# EAGLE design BPW5017-VGA (EAGLE 5.11)
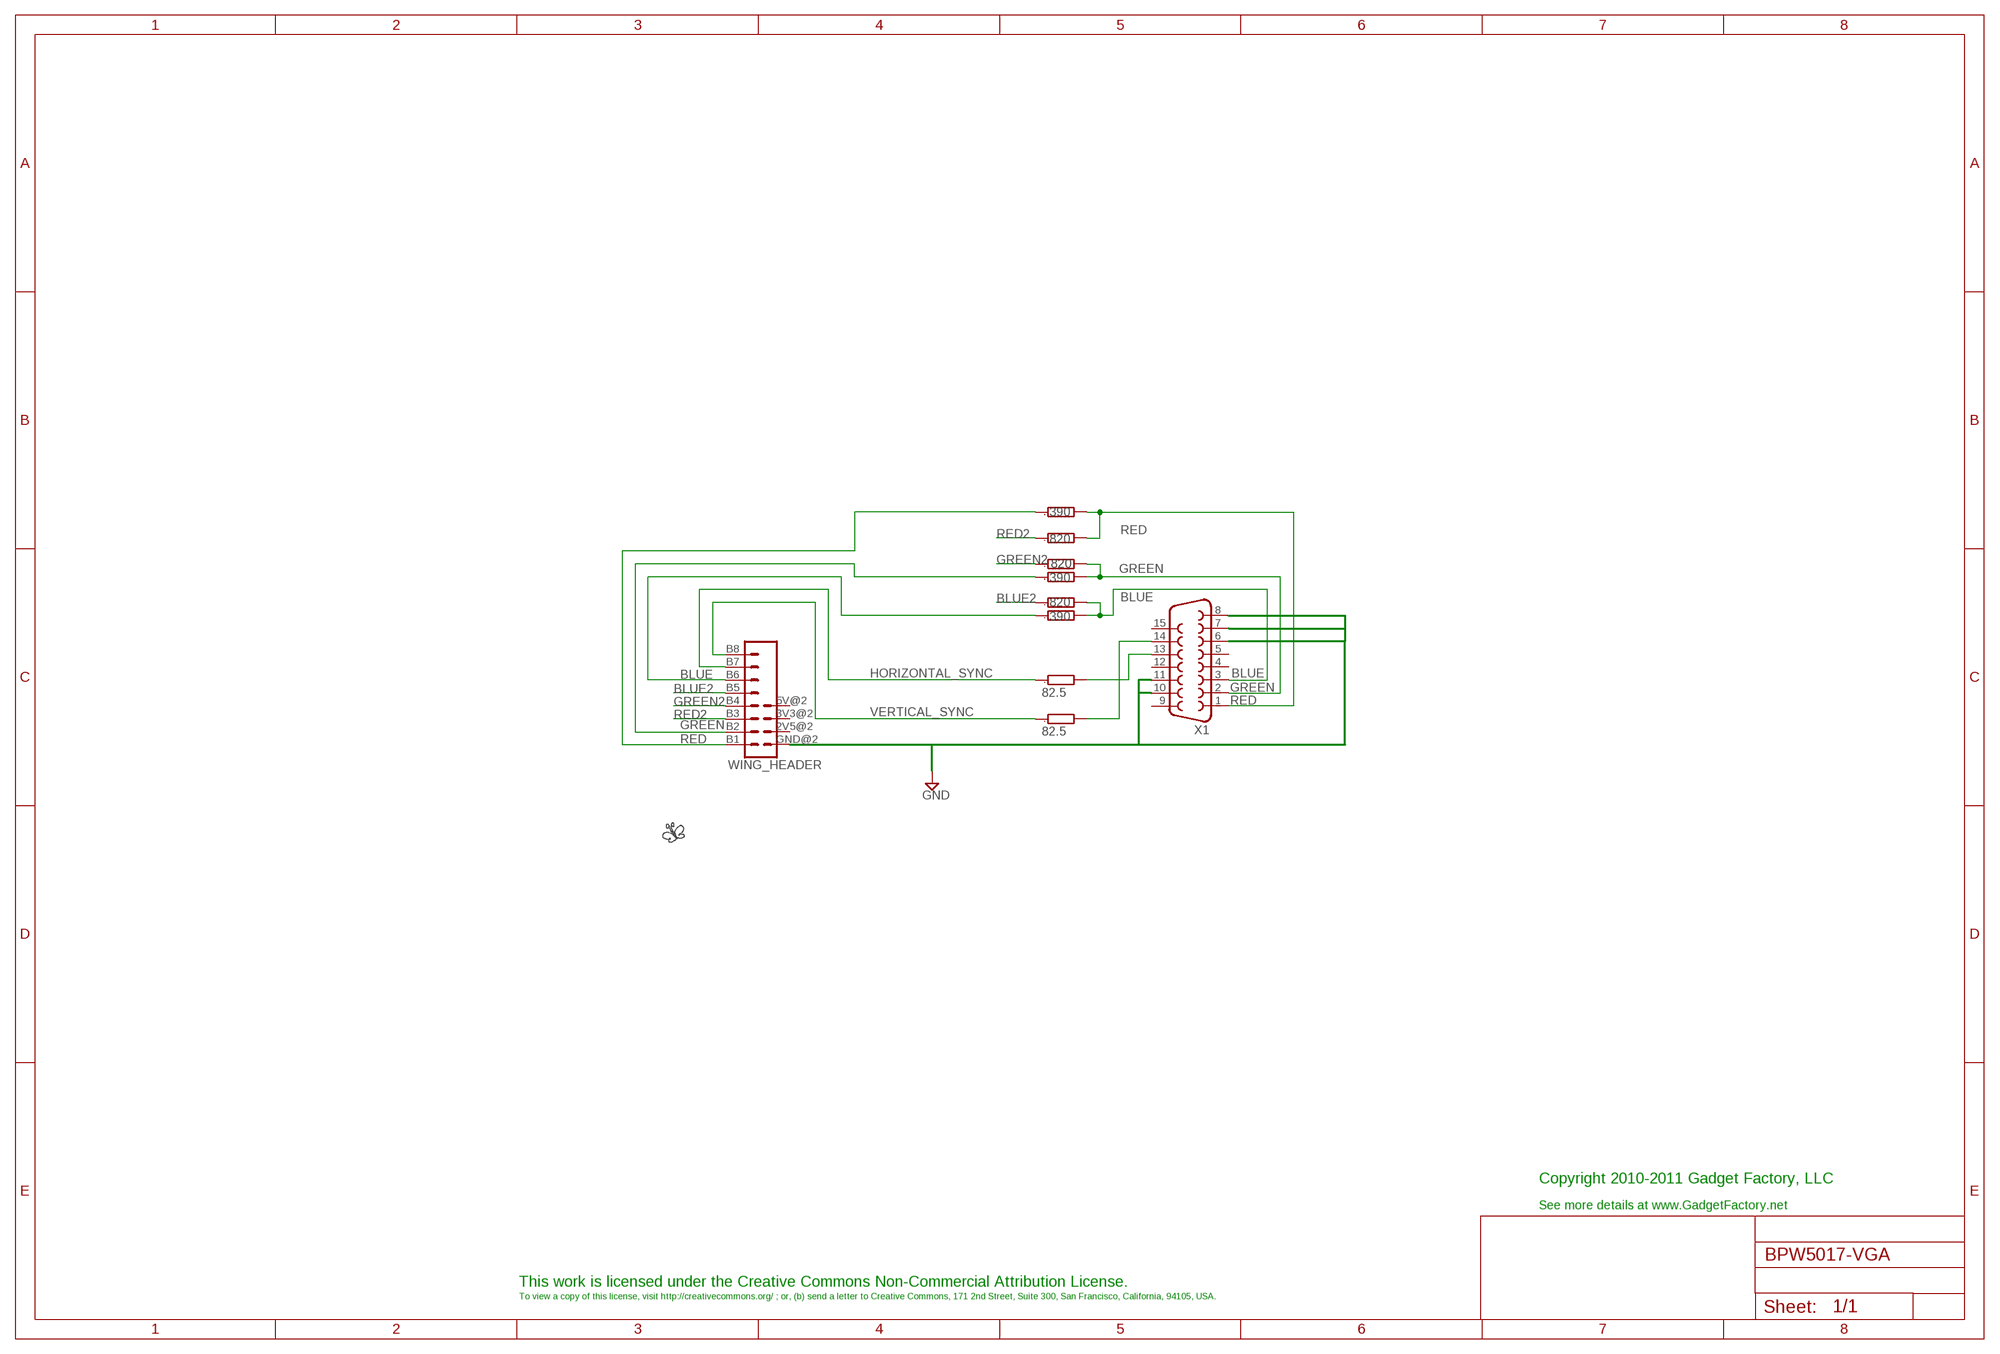
[diagram p0: schematic, sheet 1]

## Parts
LOGO1  BUTTERFLY_LOGO  [BUTTERFLY_LOGO]
R1  390  R  [DUALRESISTOR]
R2  390  R  [DUALRESISTOR]
R3  390  R  [DUALRESISTOR]
R4  820  R  [DUALRESISTOR]
R5  820  R  [DUALRESISTOR]
R6  820  R  [DUALRESISTOR]
R7  82.5  R  [DUALRESISTOR]
R8  82.5  R  [DUALRESISTOR]
WING_HEADER  WING_8BIT  [WINGSIDE_8BIT]
X1  F15HDH  [HDF15H]

## Nets
BLUE: R3.2 R6.2 X1.3
BLUE2: R6.1 WING_HEADER.B5
GND: WING_HEADER.GND@2(GND) X1.6 X1.7 X1.8 X1.10 X1.11
GREEN: R2.2 R5.2 X1.2
GREEN2: R5.1 WING_HEADER.B4
HORIZONTAL_SYNC: R7.1 WING_HEADER.B7
N$4: R7.2 X1.13
N$5: R8.2 X1.14
N$6: R1.1 WING_HEADER.B1
N$7: R2.1 WING_HEADER.B2
N$8: R3.1 WING_HEADER.B6
RED: R1.2 R4.2 X1.1
RED2: R4.1 WING_HEADER.B3
VERTICAL_SYNC: R8.1 WING_HEADER.B8
Unconnected: WING_HEADER.2V5@2(2V5) WING_HEADER.3V3@2(3V3) WING_HEADER.5V@2(5V) X1.4 X1.5 X1.9 X1.12 X1.15

## Notes on the sheet
- BLUE
- GREEN
- RED
- Copyright 2010-2011 Gadget Factory, LLC
- See more details at www.GadgetFactory.net
- This work is licensed under the Creative Commons Non-Commercial Attribution License.
- To view a copy of this license, visit http://creativecommons.org/ ; or, (b) send a letter to Creative Commons, 171 2nd Street, Suite 300, San Francisco, California, 94105, USA.

## Library data of the parts
LOGO1 = GadgetFactory_Pub:BUTTERFLY_LOGO
R1-R8 = GadgetFactory:R: RESISTOR, European symbol
WING_HEADER = GadgetFactory_Pub:WING_8BIT
X1 = GadgetFactory:F15: SUB-D; OC_FARNELL: unknown; OC_NEWARK: unknown

## Board
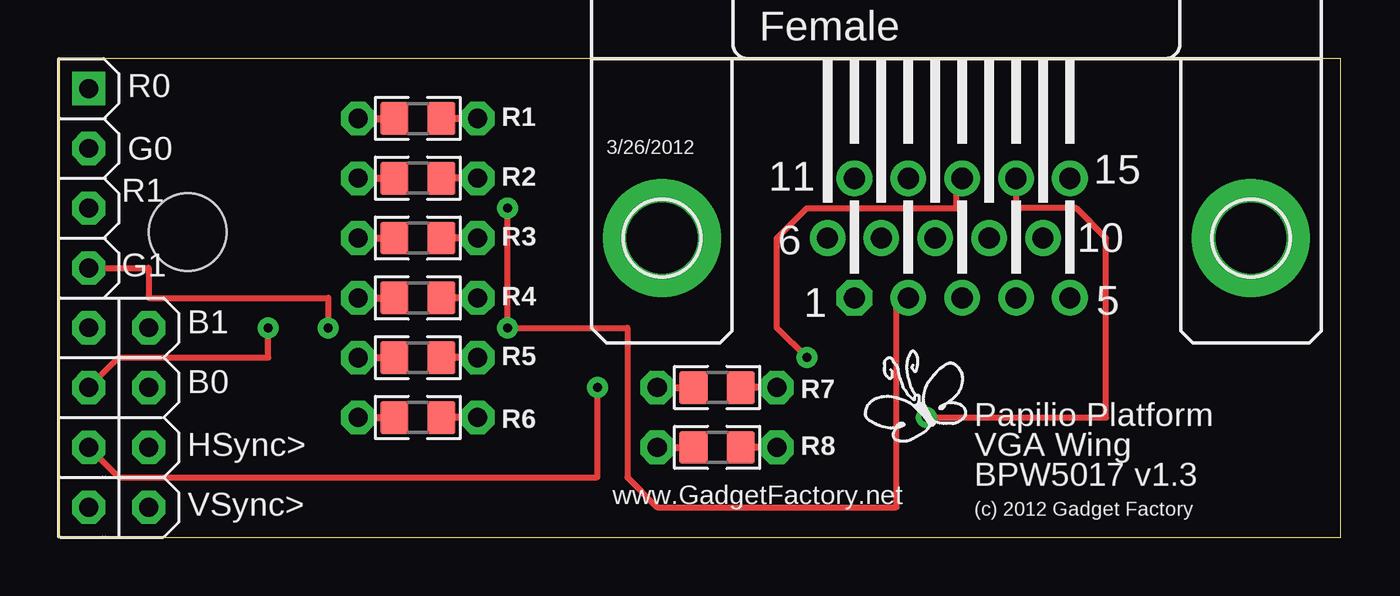
[diagram p1: board, top side]
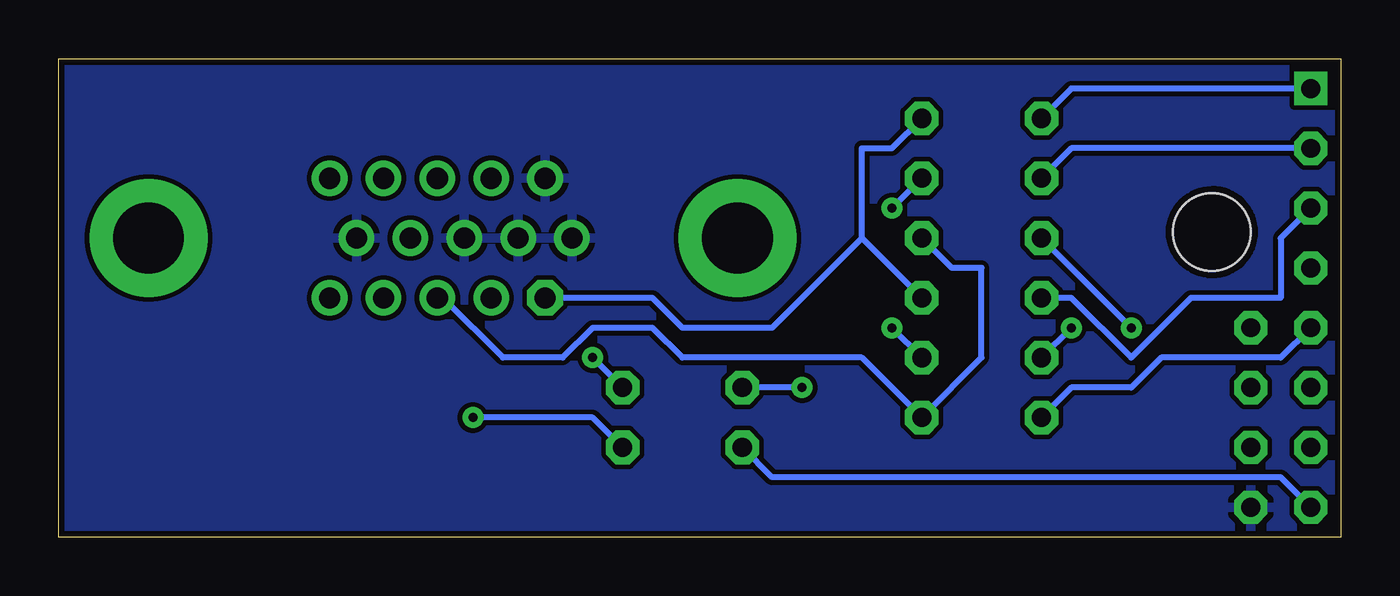
[diagram p2: board, bottom side, seen from below]

Size 54.41 x 20.31 mm. Coordinates in mm from the lower left corner, seen from the top.
Outline: 0,0 54.41,0 54.41,20.31 0,20.31 0,0
Copper layers (1*16): Top 0.035mm / dielectric 1.5mm / Bottom 0.035mm
Design rules "SparkFun_Derived_GoldePheonix_10mil": minimum track width 10mil, minimum drill 15mil, track to track 8mil, track to pad 8mil, pad to pad 8mil, via to via 8mil, smd to smd 8mil, copper to edge 10mil, drill to drill 8mil, minimum pad ring 12mil, minimum via ring 10mil, stop-mask expansion 4mil, vias tented up to drill 18mil, thermal gap 10mil

### Footprints (pad centres in the part's own frame; a part is rotated, then mirrored left to right if it is on the bottom)
DUALRESISTOR = drill 0.813 octagon: 1 -2.543,0; 2 2.537,0 | smd 1.2 x 1.4: 3 -1,0; 4 1,0
WINGSIDE_8BIT = drill 0.8 octagon: 2V5@2 16.51,3.81; 3V3@2 13.97,3.81; 5V@2 11.43,3.81; B2 3.81,1.27; B3 6.35,1.27; B4 8.89,1.27; B5 11.43,1.27; B6 13.97,1.27; B7 16.51,1.27; B8 19.05,1.27; GND@2 19.05,3.81 | drill 0.8 square: B1 1.27,1.27 | hole 3.302: 7.366,5.461
HDF15H = drill 0.9 octagon: 1 4.329,2.54 | drill 0.9 round: 2 2.043,2.54; 3 -0.243,2.54; 4 -2.529,2.54; 5 -4.815,2.54; 6 5.472,0; 7 3.186,0; 8 0.9,0; 9 -1.386,0; 10 -3.672,0; 11 4.329,-2.54; 12 2.043,-2.54; 13 -0.243,-2.54; 14 -2.529,-2.54; 15 -4.815,-2.54 | drill 3 pad 5 round: P$1 -12.5,0; P$2 12.5,0

### Placement (x,y rotation side)
LOGO1  36.45,5.46 0 top
R1  15.24,17.78 0 top
R2  15.24,15.24 0 top
R3  15.24,12.7 0 top
R4  15.24,10.16 0 top
R5  15.24,7.62 0 top
R6  15.24,5.08 0 top
R7  27.94,6.35 0 top
R8  27.94,3.81 0 top
WING_HEADER  0,20.32 270 top
X1  38.1,12.7 180 top

### Tracks (layer width: path | path; a pad name or v marks a point on that pad's centre or on a via)
BLUE
  Bottom 0.254: R6.2 15.24,7.62 15.24,11.43 16.51,11.43 R3.2 | R6.2 20.32,7.62 27.94,7.62 29.21,8.89 31.75,8.89 33.02,7.62 35.56,7.62 38.1,10.16 X1.3 | R6.2
BLUE2
  Bottom 0.254: WING_HEADER.B5 2.54,7.62 7.62,7.62 8.89,6.35 11.43,6.35 R6.1
GND
  pour Bottom: 0,20.32 54.61,20.32 54.61,0 0,0
GREEN  (via drill 0.38)
  Top 0.254: X1.2 35.56,10.16 35.56,1.27 25.4,1.27 24.13,2.54 24.13,8.89 v19.05,8.89 v19.05,13.97
  Bottom 0.254: v19.05,8.89 R5.2 | v19.05,13.97 R2.2
GREEN2  (via drill 0.38)
  Top 0.254: WING_HEADER.B4 3.81,11.43 3.81,10.16 11.43,10.16 v11.43,8.89
  Bottom 0.254: v11.43,8.89 R5.1
HORIZONTAL_SYNC  (via drill 0.38)
  Top 0.254: WING_HEADER.B7 2.54,2.54 22.86,2.54 v22.86,6.35
  Bottom 0.254: v22.86,6.35 R7.1
N$4  (via drill 0.38)
  Top 0.254: v31.75,7.62 30.48,8.89 30.48,12.7 31.75,13.97 38.1,13.97 38.1,15.24 X1.13
  Bottom 0.254: v31.75,7.62 R7.2
N$5  (via drill 0.38)
  Top 0.254: v36.83,5.08 44.45,5.08 44.45,12.7 43.18,13.97 40.64,13.97 X1.14
  Bottom 0.254: v36.83,5.08 31.75,5.08 R8.2
N$6
  Bottom 0.254: WING_HEADER.B1 11.43,19.05 R1.1
N$7
  Bottom 0.254: WING_HEADER.B2 11.43,16.51 R2.1
N$8  (via drill 0.38)
  Top 0.254: WING_HEADER.B6 2.54,7.62 8.89,7.62 v8.89,8.89
  Bottom 0.254: v8.89,8.89 R3.1
RED
  Bottom 0.254: 20.32,12.7 R4.2 | 20.32,12.7 20.32,16.51 19.05,16.51 R1.2 | 20.32,12.7 24.13,8.89 27.94,8.89 29.21,10.16 X1.1
RED2
  Bottom 0.254: WING_HEADER.B3 2.54,12.7 2.54,10.16 6.35,10.16 8.89,7.62 11.43,10.16 R4.1
VERTICAL_SYNC
  Bottom 0.254: WING_HEADER.B8 2.54,2.54 24.13,2.54 R8.1

### Text on the board
tPlace: R0 | G0 | 3/26/2012 | R1 | G1 | B1 | B0 | Papilio Platform | HSync> | VGA Wing | BPW5017 v1.3 | VSync> | www.GadgetFactory.net | (c) 2012 Gadget Factory